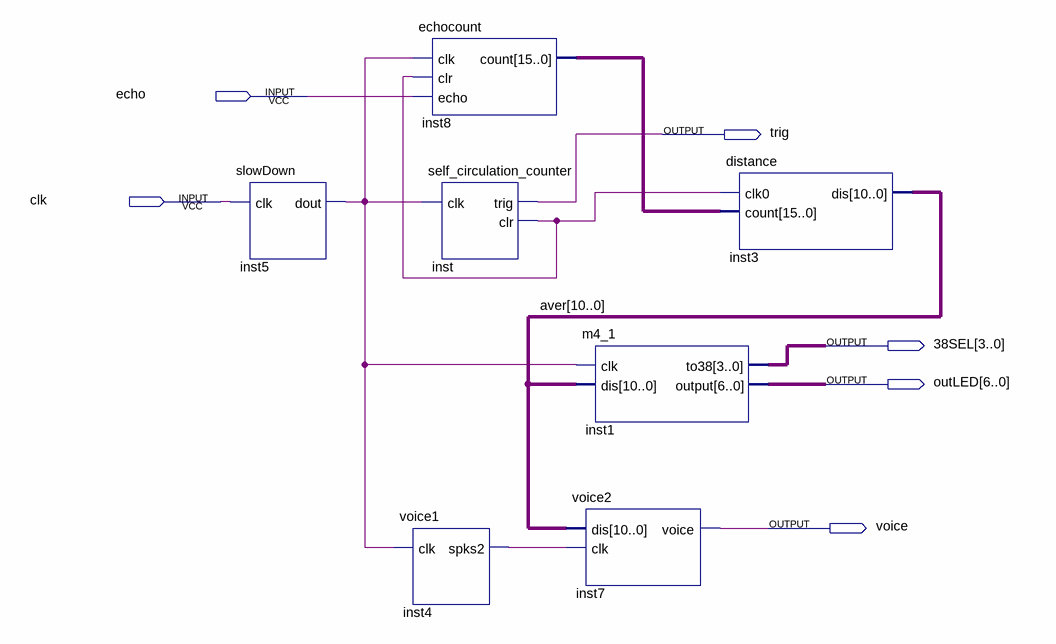
[diagram p0: schematic sheet]
// Quartus schematic sumUP.bdf as structural Verilog: 7 symbols, 6 pins
module sumUP (
  input  echo,
  input  clk,
  output trig,
  output [3:0] \38SEL ,
  output [6:0] outLED,
  output voice
);

  wire inst4_spks2, inst5_dout, inst_clr;
  wire [10:0] aver;
  wire [15:0] inst8_count;

  slowDown inst5 (.clk(clk), .dout(inst5_dout));
  echocount inst8 (.clk(inst5_dout), .clr(inst_clr), .echo(echo), .count(inst8_count));
  self_circulation_counter inst (.clk(inst5_dout), .trig(trig), .clr(inst_clr));
  voice1 inst4 (.clk(inst5_dout), .spks2(inst4_spks2));
  m4_1 inst1 (.clk(inst5_dout), .dis(aver), .to38(\38SEL ), .\output (outLED));
  voice2 inst7 (.dis(aver), .clk(inst4_spks2), .voice(voice));
  distance inst3 (.clk0(inst_clr), .count(inst8_count), .dis(aver));
endmodule
